# EasyEDA Pro project 平衡车主板.eprj, board PCB1
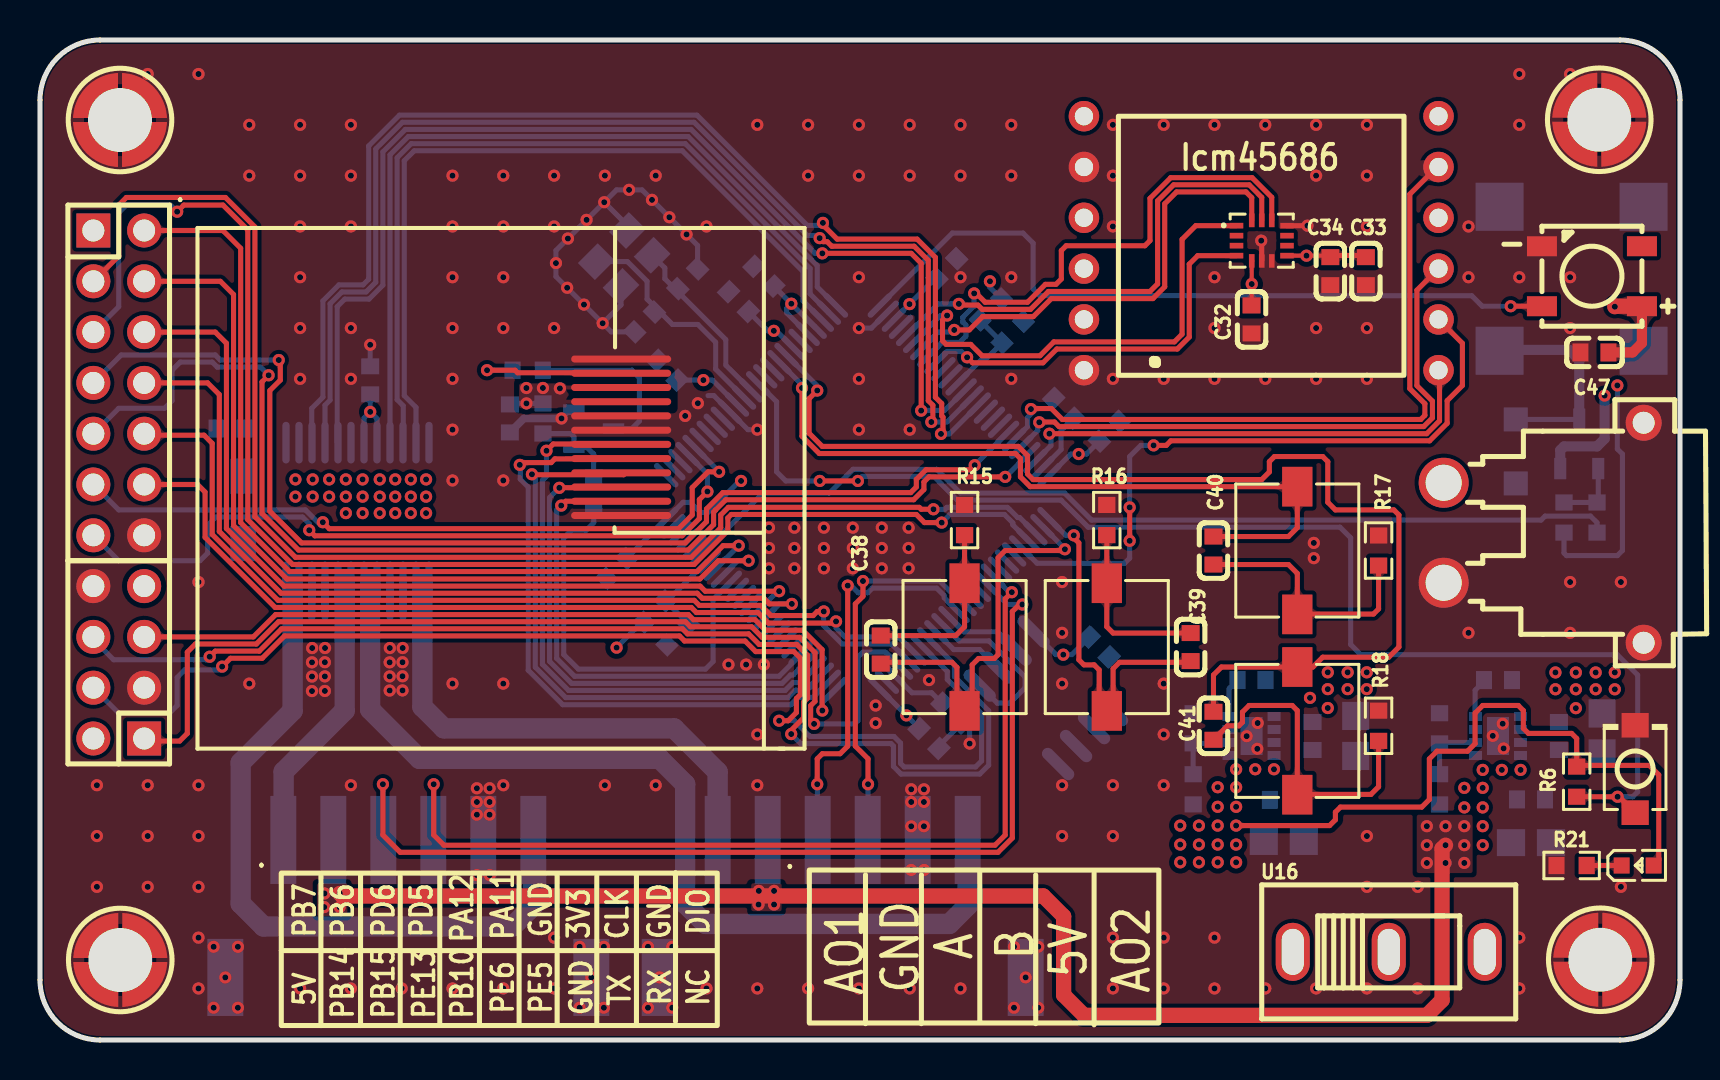
[diagram p1: board, top side]
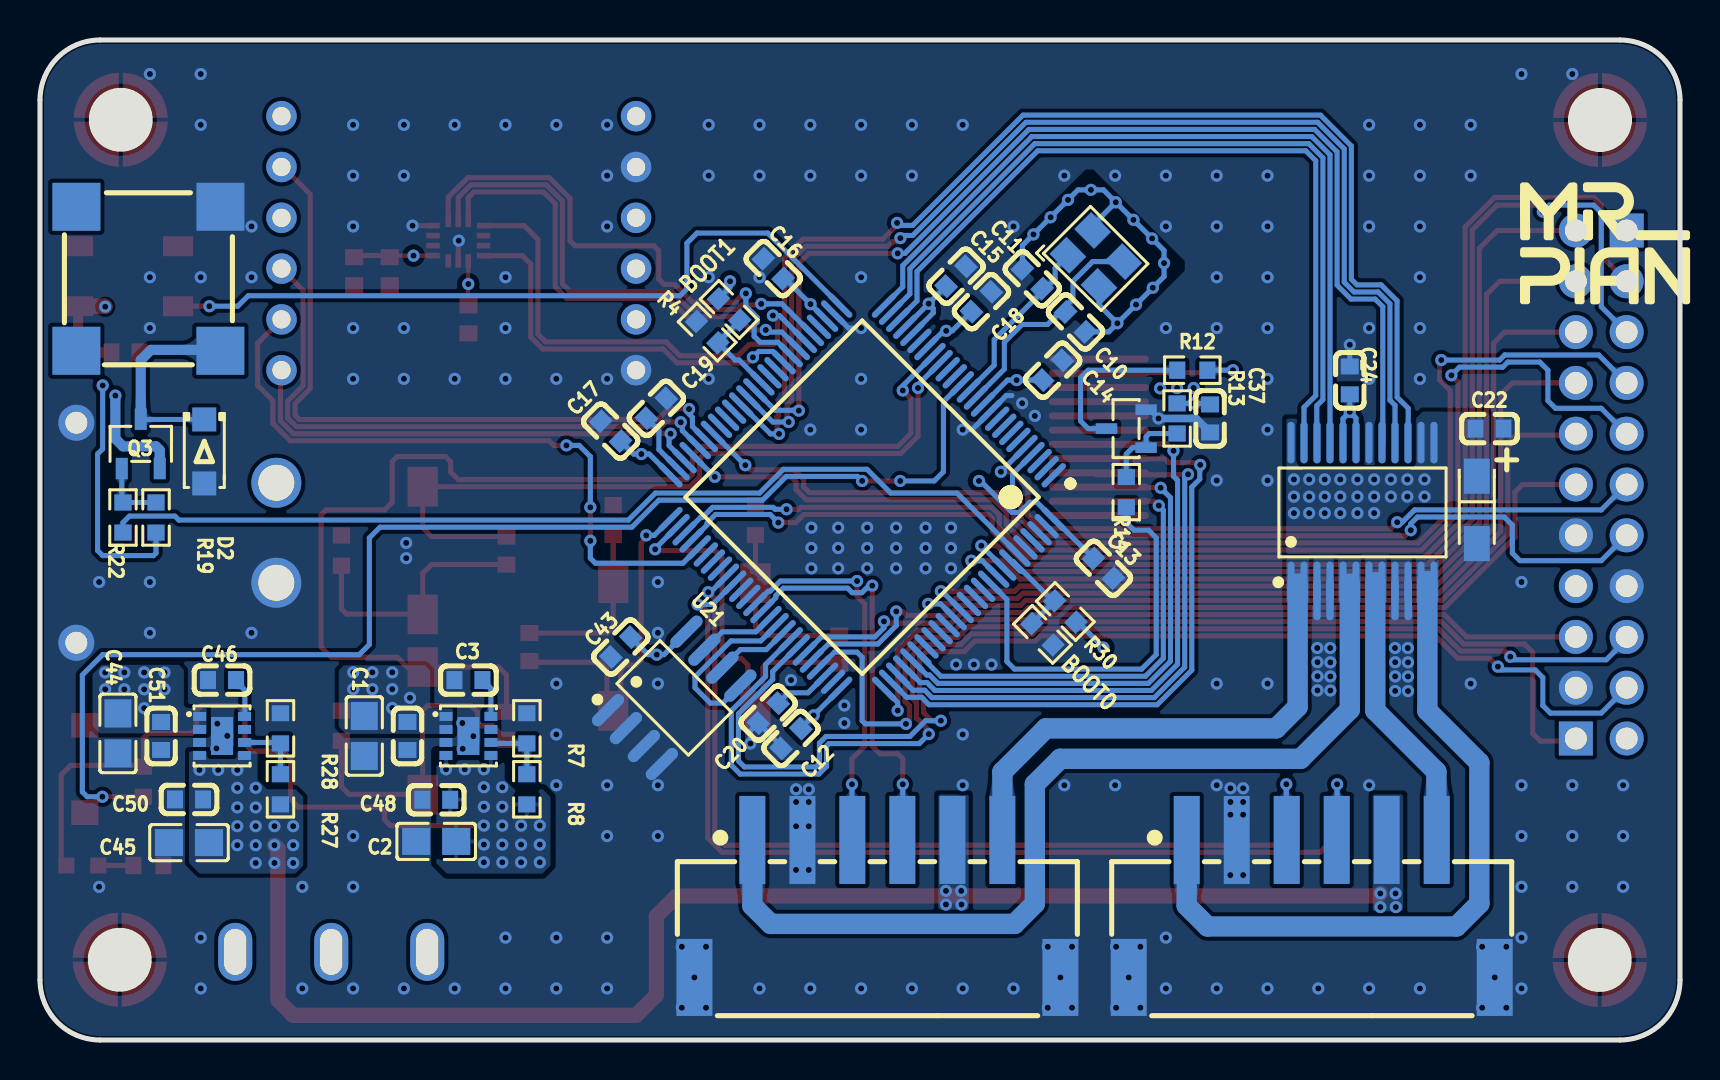
[diagram p2: board, bottom side, seen from below]

Outline 82 x 50 mm; copper layers: Top Layer, PWR, GND, Bottom Layer. Coordinates in mm from the lower left corner of the outline.
Outline path: 0,47 0,3 arc(0.88,0.88) 3,0 79,0 arc(81.12,0.88) 82,3 82,47 arc(81.12,49.12) 79,50 3,50 arc(0.88,49.12) 0,47
Stack: Top Layer 0.035mm 外层铜厚1oz / Dielectric1 0.2104mm 7628 RC49% 8.6mil / PWR 0.035mm / Dielectric2 1.065mm 1.1mm H/HOZ Copper / GND 0.035mm / Dielectric3 0.2104mm 7628 RC49% 8.6mil / Bottom Layer 0.035mm 外层铜厚1oz

## Design rules (mm)
template: 自定义配置
spacing copperThickness1oz (default): track to track 0.102, other pairs 0 to 0.3
spacing copperThickness2oz: track to track 0.203, other pairs 0.152 to 0.3
track width copperThickness1oz (default): min 0.127, default 0.254, max 2.54
track width copperThickness2oz: min 0.203, default 0.254, max 2.54
differential pair differentialPair (default): width min 0.127, default 0.254, max 2.54; gap min 0.152, default 0.152
via viaSize (default): diameter min 0.5, default 0.61, max 10; hole min 0.3, default 0.305, max 6.3
net GND uses innerPlane
net VDD uses copperRegion

## Placement (name value [footprint] x y rotation side)
C1  10uF  [C0805]  65.79 15.2 270 bottom
C2  22uF  [C0805]  62.19 9.93 180 bottom
C3  3.3nF  [C0603]  60.58 18 0 bottom
C10  20pF  [C0603]  30.23 35.9 45 bottom
C11  20pF  [C0603]  32.38 38.06 45 bottom
C12  100nF  [C0603]  44.45 15.08 135 bottom
C13  100nF  [C0603]  28.83 23.58 45 bottom
C14  100nF  [C0603]  31.37 33.49 315 bottom
C15  100nF  [C0603]  36.19 38.19 315 bottom
C16  100nF  [C0603]  45.34 38.57 225 bottom
C17  100nF  [C0603]  53.47 30.44 225 bottom
C18  100nF  [C0603]  34.92 36.92 315 bottom
C19  2.2uF  [C0603]  51.18 31.59 315 bottom
C20  2.2uF  [C0603]  45.59 16.35 135 bottom
C22  100nF  [C0603]  9.52 30.57 180 bottom
C24  100nF  [C0603]  16.51 32.98 90 bottom
C32  10nF  [C0603]  60.58 36.03 90 top
C33  2.2uF  [C0603]  66.29 38.44 90 top
C34  100nF  [C0603]  64.52 38.44 90 top
C35  10uF  [CAP-SMD_L3.2-W1.6-RD-C7171]  10.16 26.51 270 bottom
C37  100nF  [C0603]  23.5 31.08 270 bottom
C38  100nF  [C0603]  42.04 19.52 270 top
C39  100nF  [C0603]  57.53 19.65 270 top
C40  100nF  [C0603]  58.67 24.47 90 top
C41  100nF  [C0603]  58.67 15.71 90 top
C43  100nF  [C0603]  52.96 19.65 315 bottom
C44  10uF  [C0805]  78.1 15.33 270 bottom
C45  22uF  [C0805]  74.55 9.87 180 bottom
C46  3.3nF  [C0603]  72.9 18 0 bottom
C47  100nF  [C0603]  77.72 34.38 0 top
C48  100nF  [C0603]  62.19 12.01 0 bottom
C49  100nF  [C0603]  63.63 15.2 270 bottom
C50  100nF  [C0603]  74.55 12.03 0 bottom
C51  100nF  [C0603]  75.95 15.2 270 bottom
CN1  XT30PW-M30.G.Y  [CONN-TH_XT30PW-M]  75.18 25.36 90 top
CN2  HCZZ0021-6  [CONN-SMD_HCZZ0021-6]  18.41 6.57 180 bottom
CN3  HCZZ0021-6  [CONN-SMD_HCZZ0021-6]  40.13 6.57 180 bottom
D2  1N4007 A7  [SOD-123FL_L2.8-W1.8-LS3.7-RD]  73.79 29.43 270 bottom
H1  PZ254V-12-8P  [HDR-TH_8P-P2.54-V-M-R2-C4-S2.54]  3.94 18.89 90 top
H3  PZ254V-12-14P  [HDR-TH_14P-P2.54-V-M-R2-C7-S2.54]  3.94 32.86 270 top
LED1  NCD0603R1  [LED0603-RD]  79.88 8.73 0 top
LED2  XL-5050RGBC-WS2812B  [LED-SMD_4P-L5.0-W5.0-BL_XL-5050RGBC]  77.6 38.19 90 top
Q3  S8550  [SOT-23-3_L2.9-W1.6-P1.90-LS2.8-BR]  76.96 29.81 270 bottom
Q4  S8050  [SOT-23-3_L2.9-W1.3-P1.90-LS2.3-BR]  27.69 30.57 180 bottom
R4  10kΩ  [R0603]  48.64 35.4 45 bottom
R5  10kΩ  [R0603]  31.88 20.28 225 bottom
R6  10kΩ  [R0603]  76.84 12.92 90 top
R7  24kΩ  [R0603]  57.66 15.58 90 bottom
R8  75kΩ  [R0603]  57.66 12.54 90 bottom
R12  10Ω  [R0603]  24.38 33.49 180 bottom
R13  10kΩ  [R0603]  25.15 31.08 270 bottom
R14  1kΩ  [R0603]  27.69 27.39 90 bottom
R15  10kΩ  [R0603]  46.23 26 270 top
R16  10kΩ  [R0603]  53.34 26 270 top
R17  10kΩ  [R0603]  66.93 24.47 270 top
R18  10kΩ  [R0603]  66.93 15.71 270 top
R19  10kΩ  [R0603]  76.2 26.12 90 bottom
R21  1kΩ  [R0603]  76.58 8.73 0 top
R22  1kΩ  [R0603]  77.85 26.12 90 bottom
R27  52.3kΩ  [R0603]  69.98 12.54 90 bottom
R28  10kΩ  [R0603]  69.98 15.58 90 bottom
R29  0Ω  [R0603]  47.54 36.53 45 bottom
R30  0Ω  [R0603]  30.73 21.43 225 bottom
SW3  TS-1088-AR02016  [SW-SMD_L3.9-W3.0-P4.45]  79.76 13.55 90 top
U1  STM32F407VET6  [LQFP-100_L14.0-W14.0-P0.50-LS16.0-BL]  40.89 27.14 45 bottom
U2  TPS82130SILR  [USIP-8_L3.0-W2.8-P0.65-TL-EP]  60.58 15.2 180 bottom
U3  TB6612FNG(O,C,8,EL  [SSOP-24_L8.4-W5.8-P0.65-LS7.8-BL]  15.88 26.38 180 bottom
U4  ICM-42688-P  [LGA-14_L3.0-W2.5-P0.50-TL]  61.09 39.97 0 top
U6  铜柱M3*5+6  [SMD_BD4.2-L4.7-W4.7-D3.0]  4 46 0 top
U7  铜柱M3*5+6  [SMD_BD4.2-L4.7-W4.7-D3.0]  4.01 4 0 top
U8  铜柱M3*5+6  [SMD_BD4.2-L4.7-W4.7-D3.0]  78.01 4.01 0 top
U9  铜柱M3*5+6  [SMD_BD4.2-L4.7-W4.7-D3.0]  77.96 46.01 0 top
U11  ST7789V-12PIN 1.3寸LCD  [ST7789V-12PIN]  38.23 14.57 90 top
U12  TS-1199A26050  [SW-SMD_L6.0-W6.0-LS6.6]  46.23 19.65 90 top
U13  TS-1199A26050  [SW-SMD_L6.0-W6.0-LS6.6]  53.34 19.65 90 top
U14  TS-1199A26050  [SW-SMD_L6.0-W6.0-LS6.6]  62.87 24.47 270 top
U15  TS-1199A26050  [SW-SMD_L6.0-W6.0-LS6.6]  62.87 15.46 270 top
U16  SS12D10G5  [SW-TH_SHOU-HAN_SS12D10G4]  67.44 4.41 0 top
U18  TPS82130SILR  [USIP-8_L3.0-W2.8-P0.65-TL-EP]  72.9 15.2 180 bottom
U19  2.731kHz  [BUZ-SMD_4P-L8.5-W8.5-P8.50-TL-A]  76.58 38.06 0 bottom
U20  -  [15轴imu]  60.96 40.22 0 top
U21  CAT24C256WI-GT3  [SOIC-8_L4.9-W3.9-P1.27-LS6.0-BL]  50.29 17.11 225 bottom
X1  8MHz  [OSC-SMD_4P-L3.2-W2.5-BL]  29.21 39.08 225 bottom

## Footprints (pads in the part's own frame, mm; a bottom-side part is the same pattern mirrored in y, then rotated)
15轴imu
  round 1.524 hole 0.914: 1(-8.763,-6.731) 2(-8.763,-4.191) 3(-8.763,-1.651) 4(-8.763,0.889) 5(-8.763,3.429) 6(-8.763,5.969) 7(8.966,5.969) 8(8.966,3.429) 9(8.966,0.889) 10(8.966,-1.651) 11(8.966,-4.191) 12(8.966,-6.731)
BUZ-SMD_4P-L8.5-W8.5-P8.50-TL-A
  rect 2.4x2.4 smd: 1(-3.6,3.6) 2(-3.6,-3.6) 3(3.599,-3.599) 4(3.6,3.6)
C0603
  rect 0.8x0.9 smd: 1(-0.7,0) 2(0.7,0)
C0805
  rect 1.41x1.35 smd: 1(-1,0) 2(1,0)
CAP-SMD_L3.2-W1.6-RD-C7171
  rect 1.758x1.296 smd: 1(-1.687,0) 2(1.687,0)
CONN-SMD_HCZZ0021-6
  rect 1.3x4.4 smd: 1(-6.25,3.438) 2(-3.75,3.438) 3(-1.25,3.438) 4(1.25,3.438) 5(3.75,3.438) 6(6.25,3.438)
  rect 1.8x3.85 smd: 7(-9.15,-3.438) 8(9.15,-3.438)
CONN-TH_XT30PW-M
  round 2.5 hole 1.8: 1(-2.5,5) 2(2.5,5)
  round 1.8 hole 1.1: 3(5.5,-5) 4(-5.5,-5)
HDR-TH_8P-P2.54-V-M-R2-C4-S2.54
  rect 1.7x1.7 hole 1.1: 1(-3.81,-1.27)
  round 1.7 hole 1.1: 2(-3.81,1.27) 3(-1.27,-1.27) 4(-1.27,1.27) 5(1.27,-1.27) 6(1.27,1.27) 7(3.81,-1.27) 8(3.81,1.27)
HDR-TH_14P-P2.54-V-M-R2-C7-S2.54
  rect 1.7x1.7 hole 1.1: 1(-7.62,-1.27)
  round 1.7 hole 1.1: 2(-7.62,1.27) 3(-5.08,-1.27) 4(-5.08,1.27) 5(-2.54,-1.27) 6(-2.54,1.27) 7(0,-1.27) 8(0,1.27) 9(2.54,-1.27) 10(2.54,1.27) 11(5.08,-1.27) 12(5.08,1.27) 13(7.62,-1.27) 14(7.62,1.27)
LED0603-RD
  rect 0.8x0.8 smd: 1(-0.799,0) 2(0.799,0)
LED-SMD_4P-L5.0-W5.0-BL_XL-5050RGBC
  rect 1x1.5 smd: 1(-1.5,-2.5) 2(1.5,-2.5) 3(1.5,2.5) 4(-1.5,2.5)
LGA-14_L3.0-W2.5-P0.50-TL
  rect 0.675x0.28 smd: 1(-1.262,0.75) 2(-1.262,0.25) 3(-1.262,-0.25) 4(-1.262,-0.75) 8(1.262,-0.75) 9(1.262,-0.25) 10(1.262,0.25) 11(1.262,0.75)
  rect 0.28x0.675 smd: 5(-0.5,-1.012) 6(0,-1.012) 7(0.5,-1.012) 12(0.5,1.012) 13(0,1.012) 14(-0.5,1.012)
LQFP-100_L14.0-W14.0-P0.50-LS16.0-BL
  oval 0.3x1.6 smd: 1(-6,-7.55) 2(-5.5,-7.55) 3(-5,-7.55) 4(-4.5,-7.55) 5(-4,-7.55) 6(-3.5,-7.55) 7(-3,-7.55) 8(-2.5,-7.55) 9(-2,-7.55) 10(-1.5,-7.55) 11(-1,-7.55) 12(-0.5,-7.55) 13(0,-7.55) 14(0.5,-7.55) 15(1,-7.55) 16(1.5,-7.55) 17(2,-7.55) 18(2.5,-7.55) 19(3,-7.55) 20(3.5,-7.55) 21(4,-7.55) 22(4.5,-7.55) 23(5,-7.55) 24(5.5,-7.55) 25(6,-7.55) 51(6,7.55) 52(5.5,7.55) 53(5,7.55) 54(4.5,7.55) 55(4,7.55) 56(3.5,7.55) 57(3,7.55) 58(2.5,7.55) 59(2,7.55) 60(1.5,7.55) 61(1,7.55) 62(0.5,7.55) 63(0,7.55) 64(-0.5,7.55) 65(-1,7.55) 66(-1.5,7.55) 67(-2,7.55) 68(-2.5,7.55) 69(-3,7.55) 70(-3.5,7.55) 71(-4,7.55) 72(-4.5,7.55) 73(-5,7.55) 74(-5.5,7.55) 75(-6,7.55)
  oval 1.6x0.3 smd: 26(7.55,-6) 27(7.55,-5.5) 28(7.55,-5) 29(7.55,-4.5) 30(7.55,-4) 31(7.55,-3.5) 32(7.55,-3) 33(7.55,-2.5) 34(7.55,-2) 35(7.55,-1.5) 36(7.55,-1) 37(7.55,-0.5) 38(7.55,0) 39(7.55,0.5) 40(7.55,1) 41(7.55,1.5) 42(7.55,2) 43(7.55,2.5) 44(7.55,3) 45(7.55,3.5) 46(7.55,4) 47(7.55,4.5) 48(7.55,5) 49(7.55,5.5) 50(7.55,6) 76(-7.55,6) 77(-7.55,5.5) 78(-7.55,5) 79(-7.55,4.5) 80(-7.55,4) 81(-7.55,3.5) 82(-7.55,3) 83(-7.55,2.5) 84(-7.55,2) 85(-7.55,1.5) 86(-7.55,1) 87(-7.55,0.5) 88(-7.55,0) 89(-7.55,-0.5) 90(-7.55,-1) 91(-7.55,-1.5) 92(-7.55,-2) 93(-7.55,-2.5) 94(-7.55,-3) 95(-7.55,-3.5) 96(-7.55,-4) 97(-7.55,-4.5) 98(-7.55,-5) 99(-7.55,-5.5) 100(-7.55,-6)
OSC-SMD_4P-L3.2-W2.5-BL
  rect 1.4x1.2 smd: 1(-1.1,-0.875) 2(1.1,-0.875) 3(1.1,0.875) 4(-1.1,0.875)
R0603
  rect 0.806x0.864 smd: 1(-0.753,0) 2(0.753,0)
SMD_BD4.2-L4.7-W4.7-D3.0
  custom 2.25x2.25 smd: 1(-1.225,1.443) 1(-1.225,-1.442) 1(1.225,1.443) 1(1.225,-1.443)
SOD-123FL_L2.8-W1.8-LS3.7-RD
  rect 1.2x1.2 smd: 1(-1.6,0) 2(1.6,0)
SOIC-8_L4.9-W3.9-P1.27-LS6.0-BL
  oval 0.588x2.045 smd: 1(-1.905,-2.772) 2(-0.635,-2.772) 3(0.635,-2.772) 4(1.905,-2.772) 5(1.905,2.772) 6(0.635,2.772) 7(-0.635,2.772) 8(-1.905,2.772)
SOT-23-3_L2.9-W1.3-P1.90-LS2.3-BR
  rect 1.07x0.532 smd: 1(0.99,-0.95) 2(0.99,0.95) 3(-0.99,0)
SOT-23-3_L2.9-W1.6-P1.90-LS2.8-BR
  rect 1.07x0.6 smd: 1(1.235,-0.95) 2(1.235,0.95) 3(-1.235,0)
SSOP-24_L8.4-W5.8-P0.65-LS7.8-BL
  oval 0.364x2.082 smd: 1(-3.575,-3.491) 2(-2.925,-3.491) 3(-2.275,-3.491) 4(-1.625,-3.491) 5(-0.975,-3.491) 6(-0.325,-3.491) 7(0.325,-3.491) 8(0.975,-3.491) 9(1.625,-3.491) 10(2.275,-3.491) 11(2.925,-3.491) 12(3.575,-3.491) 13(3.575,3.491) 14(2.925,3.491) 15(2.275,3.491) 16(1.625,3.491) 17(0.975,3.491) 18(0.325,3.491) 19(-0.325,3.491) 20(-0.975,3.491) 21(-1.625,3.491) 22(-2.275,3.491) 23(-2.925,3.491) 24(-3.575,3.491)
ST7789V-12PIN
  custom 0.35x4.999 smd: 1(19.482,9.169) 2(18.77,9.169) 3(18.059,9.169) 4(17.348,9.169) 5(16.637,9.169) 6(15.926,9.169) 7(15.214,9.169) 8(14.504,9.169) 9(13.792,9.169) 10(13.081,9.169) 11(12.37,9.169) 12(11.659,9.169)
SW-SMD_L3.9-W3.0-P4.45
  rect 1.23x1.36 smd: 1(-2.185,0) 2(2.185,0)
SW-SMD_L6.0-W6.0-LS6.6
  rect 1.985x1.512 smd: 1(-3.192,0) 2(3.192,0)
SW-TH_SHOU-HAN_SS12D10G4
  oval 1.7x2.9 hole 1.1x2.3: 1(-4.8,0) 2(0,0) 3(4.8,0)
USIP-8_L3.0-W2.8-P0.65-TL-EP
  rect 0.65x0.45 smd: 1(-1.125,0.975) 2(-1.125,0.325) 3(-1.125,-0.325) 4(-1.125,-0.975) 5(1.125,-0.975) 6(1.125,-0.325) 7(1.125,0.325) 8(1.125,0.975)
  rect 1.1x1.9 smd: 9(0,0)

## Nets
As in the schematic.

Pads without a net: H1 2; LED2 2; U1 1 2 3 6 7 8 9 15 16 29 35 36 41 42 43 56 57 58 61 62 82 83 84 85 88 89 90 96 97 98; U2 7; U4 2 3 9 10; U16 1; U18 7; U19 3 4; U20 2 3 4 7 9

## Via types
v1: diameter 0.61, hole 0.305, Top Layer to Bottom Layer, 416 vias

## Routing (per net, layer and track width the routed paths; a pad name or vN(x,y) marks a point on that pad's centre or on a via; arc(x,y) is an arc through that point)
5V: length 223.5
  Top Layer w0.508: C47.2 79.63,34.38 80.1,34.85 LED2.1
  Top Layer w0.762: v1(14.99,7.33) 15.11,7.2 50.16,7.2 51.18,6.19 51.18,2.25 52.2,1.23 69.34,1.23 70.1,1.99 70.1,9.57 v1(70.28,9.74) ; v1(78.74,36.67) 78.76,36.69 LED2.1
  PWR w0.762: 52.2,48.35 52.2,48.34 U20.6
  PWR w1.778: v1(71.21,12.61) 69.72,14.1 69.72,18.5 68.33,19.9 66.04,19.9 65.04,20.9 65.04,29.19 66.67,30.82 76.58,30.82 78.74,32.98 v1(78.74,36.67) 78.74,40.22 76.71,42.25 73.03,42.25 71.77,43.51 71.77,47.07 70.48,48.35 9.88,48.35 8.64,47.1 8.64,43.78 7.62,42.76 4.17,42.76 2.67,41.26 H3.1
  Bottom Layer w0.254: R19.1 76.2,24.35 76.33,24.22 78.87,24.22 79.12,24.47 79.12,29.3 78.87,29.55 v1(78.87,32.73)
  Bottom Layer w0.508: Q3.2 76.01,29.49 76.2,29.68 77.85,29.68 78.23,30.06 v1(78.23,32.22)
  vias: v1(14.21,6.65) v1(14.22,7.33) v1(14.98,6.65) v1(35.94,7.46) v1(35.93,6.77) v1(36.7,7.46) v1(36.7,6.77) v1(69.34,10.69) v1(69.34,9.74) v1(69.34,8.85) v1(70.28,10.69) v1(70.28,8.85) v1(71.21,11.63) v1(71.21,10.69) v1(71.21,9.74) v1(71.21,8.85) v1(72.14,13.51) v1(72.14,12.61) v1(72.14,11.63) v1(72.14,10.69) v1(72.14,9.74) v1(73.09,13.51) v1(74.03,13.51)
12.6V: length 67.2
  PWR w1.778: 15.75,26.76 15.75,15.46 16.89,14.31 24.26,14.31 25.51,13.06 25.51,8.36 27.05,6.82 32.26,6.82 34.54,4.53 45.09,4.53 47.24,6.69 60.96,6.69 62.74,8.47
  vias: v1(12.77,28.03) v1(12.77,27.17) v1(13.63,28.03) v1(13.63,27.17) v1(14.46,28.03) v1(14.46,27.17) v1(15.29,28.03) v1(15.29,27.17) v1(15.29,26.34) v1(16.13,28.03) v1(16.13,27.17) v1(16.13,26.34) v1(16.99,28.03) v1(16.99,27.17) v1(16.99,26.34) v1(17.76,28.03) v1(17.76,27.17) v1(17.76,26.34) v1(18.54,28.03) v1(18.54,27.17) v1(18.54,26.34) v1(19.3,28.03) v1(19.3,27.17) v1(19.3,26.34) v1(63.5,17.11) v1(64.39,18.38) v1(64.39,17.54) v1(64.39,16.6) v1(65.38,18.38) v1(65.38,17.54) v1(66.34,18.38) v1(66.34,17.54) v1(75.77,18.38) v1(75.77,17.54) v1(76.79,18.38) v1(76.79,17.54) v1(76.79,16.59) v1(77.78,18.38) v1(77.78,17.54) v1(78.74,18.38) v1(78.74,17.54)
12.6V_IN: length 31.1
  PWR w2.159: U16.3 72.24,6.74 73.71,8.22 75.91,8.22 77.34,9.65 77.34,13.68 77.16,13.86 77.16,13.96 74.04,17.08 74.04,26.25 72.43,27.86 CN1.2
GND: length 42.6
  Top Layer w0.254: U4.11 v1(63.37,40.72) ; v1(61.06,39.97) 61.09,39.94 U4.6
  Bottom Layer w0.254: C12.1 44.94,14.71 46.09,15.85 46.48,15.46 v1(46.48,14.82) ; v1(26.08,31.08) 26.52,31.52 Q4.2 ; v1(28.21,41.89) 29.37,40.73 X1.4 ; v1(28.21,41.89) 28.83,42.51 v1(29.45,42.51) 30.1,42.51 v1(30.6,42.01) v1(31.47,41.14) v1(32.33,40.28) 32.88,39.73 C11.2 ; v1(28.21,41.89) v1(27.33,41.01) v1(26.4,40.07) 25.8,39.48 v1(25.8,38.84) 25.8,38.17 v1(26.36,37.61) v1(27.2,36.77) v1(28.13,35.84) ; v1(28.13,35.84) 28.56,35.41 C10.1 ; v1(28.13,35.84) 29.05,36.76 X1.2 ; v1(35.87,30.52) 35.39,30.52 U1.10 33.69,32.22 33.4,32.22 ; 42.34,36.37 41.57,35.6 v1(40.94,35.6) ; C24.2 v1(16.51,34.76)
  Bottom Layer w0.381: C37.2 24.19,31.08 v1(26.08,31.08) ; U3.10 13.59,22.88 13.59,21.17 ; U3.9 14.25,21.17 ; U3.3 18.15,21.17 ; U3.4 17.5,21.17
  vias: v1(2.84,12.74) v1(2.84,10.2) v1(2.84,7.66) v1(5.38,48.3) v1(5.38,12.74) v1(5.38,10.2) v1(5.38,7.66) v1(7.92,48.3) v1(7.92,22.9) v1(7.92,12.74) v1(7.92,10.2) v1(7.92,7.66) v1(7.92,5.12) v1(7.92,2.58) v1(8.68,4.66) v1(8.68,1.61) v1(9.27,3.13) v1(9.89,4.66) v1(9.89,1.61) v1(10.46,45.76) v1(10.46,43.22) v1(10.46,17.82) v1(13,45.76) v1(13,43.22) v1(13,40.68) v1(13,38.14) v1(13,35.6) v1(13,33.06) v1(13,2.58) v1(13.61,19.6) v1(13.6,18.88) v1(13.6,18.17) v1(13.6,17.45) v1(14.25,19.6) v1(14.24,18.89) v1(14.24,18.18) v1(14.24,17.45) v1(15.55,45.76) v1(15.55,43.22) v1(15.55,40.68) v1(15.55,35.6) v1(15.55,33.06) v1(15.55,12.74) v1(15.55,2.58) v1(17.49,19.6) v1(17.48,18.88) v1(17.48,18.18) v1(17.48,17.47) v1(18.08,2.58) v1(18.13,19.6) v1(18.13,18.89) v1(18.13,18.19) v1(18.13,17.48) v1(20.62,43.22) v1(20.62,40.68) v1(20.62,38.14) v1(20.62,35.6) v1(20.62,33.06) v1(20.62,30.52) v1(20.62,27.98) v1(20.62,17.82) v1(20.62,2.58) v1(21.84,12.59) v1(21.84,11.9) v1(21.84,11.27) v1(21.84,8.25) v1(22.48,12.59) v1(22.48,11.9) v1(22.48,11.27) v1(22.48,8.25) v1(23.16,43.22) v1(23.16,40.68) v1(23.16,38.14) v1(23.16,35.6) v1(23.16,27.98) v1(23.16,17.82) v1(23.16,12.74) v1(23.16,2.58) v1(25.7,43.22) v1(25.7,40.68) v1(25.7,35.6) v1(25.7,5.12) v1(25.7,2.58) v1(26.98,4.66) v1(26.98,1.61) v1(27.56,3.13) v1(28.19,4.66) v1(28.19,1.61) v1(28.25,43.22) v1(28.25,12.74) v1(30.4,4.66) v1(30.4,1.61) v1(30.78,43.22) v1(30.78,12.74) v1(30.98,3.13) v1(31.61,4.66) v1(31.61,1.61) v1(32.26,31.2) v1(32.89,31.84) v1(33.32,40.68) v1(33.32,2.58) v1(34.42,18.77) v1(35.31,18.77) v1(35.87,45.76) v1(35.87,15.28) v1(35.87,12.74) v1(35.87,2.58) v1(36.19,18.77) v1(36.45,25.62) v1(36.45,24.6) v1(36.45,23.58) v1(37.72,25.62) v1(37.72,24.6) v1(37.72,23.58) v1(38.41,45.76) v1(38.41,43.22) v1(38.41,2.58) v1(39.2,25.62) v1(39.2,24.6) v1(39.2,23.58) v1(40.64,25.62) v1(40.64,24.6) v1(40.64,23.58) v1(40.94,45.76) v1(40.94,43.22) v1(40.94,38.14) v1(40.94,33.06) v1(40.94,30.52) v1(40.94,2.58) v1(41.78,16.73) v1(41.78,15.85) v1(42.09,25.62) v1(42.09,24.6) v1(42.09,23.58) v1(43.48,45.76) v1(43.48,43.22) v1(43.48,30.52) v1(43.43,25.62) v1(43.43,24.6) v1(43.43,23.58) v1(43.48,2.58) v1(43.56,12.54) v1(43.56,11.9) v1(43.56,10.69) v1(43.56,8.5) v1(44.2,12.54) v1(44.2,11.9) v1(44.2,10.69) v1(44.2,8.5) v1(44.45,18) v1(46.03,45.76) v1(46.03,43.22) v1(46.03,38.14) v1(46.03,2.58) v1(48.56,45.76) v1(48.56,43.22) v1(48.56,38.14) v1(48.56,33.06) v1(48.7,4.66) v1(48.7,1.61) v1(49.28,3.13) v1(49.91,4.66) v1(49.91,1.61) v1(51.1,22.9) v1(51.1,20.36) v1(51.1,17.82) v1(51.1,12.74) v1(51.1,10.2) v1(53.64,45.76) v1(53.64,43.22) v1(53.64,40.68) v1(53.64,33.06) v1(53.64,12.74) v1(53.64,10.2) v1(53.64,5.12) v1(53.64,2.58) v1(56.19,45.76) v1(56.19,33.06) v1(56.19,17.82) v1(56.19,15.28) v1(56.19,12.74) v1(56.19,5.12) v1(56.19,2.58) v1(58.72,45.76) v1(58.72,38.14) v1(58.72,35.6) v1(58.72,33.06) v1(58.72,5.12) v1(58.72,2.58) v1(60.33,15.19) v1(60.88,15.85) v1(60.86,14.56) v1(61.26,45.76) v1(61.26,33.06) v1(61.26,2.58) v1(63.69,24.85) v1(63.69,24.09) v1(63.81,45.76) v1(63.81,43.22) v1(63.81,35.6) v1(63.81,33.06) v1(63.81,2.58) v1(66.34,45.76) v1(66.34,43.22) v1(66.34,40.68) v1(66.34,35.6) v1(66.34,33.06) v1(66.34,10.2) v1(66.34,7.66) v1(66.34,2.58) v1(68.88,7.66) v1(68.88,2.58) v1(71.42,40.68) v1(71.42,38.14) v1(71.42,20.36) v1(72.64,15.21) v1(73.13,15.81) v1(73.18,14.58) v1(73.97,48.3) v1(73.97,45.76) v1(73.97,38.14) v1(73.97,5.12) v1(73.97,2.58) v1(76.5,48.3) v1(76.5,38.14) v1(76.5,35.6) v1(76.5,22.9) v1(76.5,20.36) v1(79.04,22.9) v1(79.04,7.66)
VDD: length 80.4
  Top Layer w0.203: C32.2 60.59,36.74 v1(60.59,37.8) U4.5 ; C34.2 64.44,39.22 v1(63.32,39.22) U4.8
  Top Layer w0.254: 60.58,38.95 U4.5 ; v1(59.81,10.72) 64.48,10.72 64.77,11.01 64.77,11.39 65.02,11.65 69.09,11.65 69.47,12.03 69.47,14.06 69.85,14.44 71.37,14.44 71.75,14.82 71.75,16.35 72.14,16.73 73.91,16.73 74.17,16.47 74.17,15.58 74.42,15.33 76.58,15.33 76.84,15.08 R6.2 76.9,13.73 80.47,13.73 80.94,13.26 80.94,8.98 LED1.2 ; C34.2 64.6,39.23 66.21,39.23 C33.2
  Bottom Layer w0.254: U1.75 v1(43.32,16.23) 43.83,15.72 43.83,15.57 ; v1(35.05,27.95) 34.98,27.95 33.4,26.38 33.02,26.38 32.51,26.89 32.15,26.89 31.31,26.04 31.29,26.04 C13.2 ; C37.1 23.55,31.83 v1(24.32,31.83) R13.1 ; v1(16.51,31.41) 16.85,31.07 U3.20 ; v1(16.51,31.41) 16.2,31.1 U3.19 ; v1(16.51,31.41) C24.1 ; 52.97,29.95 52.32,29.3 v1(51.93,29.3) 51.54,29.3 U1.50 ; 37.57,36.81 37.34,36.58 37.34,36.35 U1.21 ; 37.57,36.81 38.72,35.66 U1.22 ; 37.57,36.81 v1(37.57,36.82) ; 37.57,36.81 36.69,37.69 ; 42.7,36.01 42.7,36.02 v1(43.47,36.79) 44.75,38.08 44.84,38.08 ; R29.2 47.5,37.64 v1(47.5,37.94) ; C14.2 v1(33.17,33) 33.62,33 U1.11 ; R30.2 30.1,20.89 v1(28.83,19.62) ; 52.46,20.14 51.59,19.27 v1(51.16,19.27) 50.8,19.27 49.68,20.39 U21.8 ; C18.2 36.39,35.46 v1(36.69,35.46) 36.69,35.46 36.82,35.46 37.68,34.6
  vias: v1(24.32,32.6) v1(25.15,32.6) v1(26,32.58) v1(57.01,10.72) v1(57.01,9.77) v1(57.01,8.88) v1(57.95,10.72) v1(57.95,9.77) v1(57.95,8.88) v1(58.88,12.64) v1(58.88,11.66) v1(58.88,10.72) v1(58.88,9.77) v1(58.88,8.88) v1(59.81,13.54) v1(59.81,12.64) v1(59.81,11.66) v1(59.81,9.77) v1(59.81,8.88) v1(60.76,13.54) v1(61.7,13.54)
8M_IN: length 8.8
  Bottom Layer w0.254: U1.13 34.29,33.74 34.29,35.01 31.24,38.06 31.24,38.6 X1.1
8M_OUT: length 11.5
  Bottom Layer w0.254: X1.3 29.37,38.92 30.35,37.94 30.35,37.05 31.62,35.78 32.89,35.78 33.78,34.89 33.78,33.55 35.2,32.13
AIN1: length 41.2
  Bottom Layer w0.254: U3.21 17.5,44.26 18.41,45.17 32.41,45.17 38.86,38.72 38.86,37.66 39.8,36.72
AIN2: length 40.5
  Bottom Layer w0.254: U3.22 18.16,29.88 18.16,31.71 17.86,32.02 17.86,44.11 18.56,44.82 32.26,44.82 38.51,38.57 38.51,37.31 39.44,36.37
AO1: length 25.7
  Bottom Layer w1.016: 19.12,22.82 19.12,16.66 20.19,15.58 31.7,15.58 33.88,13.4 CN3.6
AO2: length 47.8
  Bottom Layer w1.016: 16.51,22.82 16.51,16.52 18.97,14.06 30.99,14.06 32.26,12.79 32.26,6.82 33.27,5.8 45.47,5.8 46.38,6.72 CN3.1
BIN1: length 56.3
  Top Layer w0.254: v1(39.12,39.33) 43.56,39.33 44.06,38.83 v1(44.06,31.47)
  Bottom Layer w0.254: v1(44.06,31.47) 44.31,31.47 44.32,31.48 45.24,31.48 U1.38 ; 14.9,29.87 14.86,29.91 14.86,36.67 15.24,37.05 16.45,37.05 17.14,37.74 17.14,44.41 18.27,45.53 32.56,45.53 38.75,39.33 v1(39.12,39.33)
BIN2: length 58.2
  Top Layer w0.254: v1(38.98,40.09) 39.16,39.92 39.36,39.92 39.59,39.69 43.71,39.69 44.41,38.98 44.41,31.97 44.64,31.74 44.64,30.98 v1(44.57,30.9)
  Bottom Layer w0.254: U1.39 45.36,30.9 v1(44.57,30.9) ; v1(38.98,40.09) 38.85,40.23 38.36,40.23 32.7,45.89 18.12,45.89 16.79,44.55 16.79,37.89 16.3,37.4 15.09,37.4 14.5,36.81 14.5,31.99 14.25,31.74 U3.16
BLK: length 20.6
  Bottom Layer w0.254: R14.1 27.69,25.87 27.31,25.49 26.57,25.49 26.19,25.11 26.19,19.27 26.92,18.54 33.27,18.54 33.66,18.92 33.66,22.02 34.49,22.86
BO1: length 36
  Bottom Layer w1.016: CN2.1 24.66,6.72 23.62,5.68 11.18,5.68 10.03,6.82 10.03,13.87 12.63,16.46 12.63,22.95
BO2: length 14
  Bottom Layer w1.016: 12.11,10.17 12.18,10.24 12.18,13.42 15.23,16.47 15.23,22.89
BOOT0: length 4.6
  Bottom Layer w0.254: U1.94 33.33,23.92 31.37,21.96 R30.1 R5.1
BOOT1: length 4.6
  Bottom Layer w0.254: R4.1 47.24,34 47.04,34 U1.37 ; 48,34.93 48,34.98 46.94,36.04
BUZZ: length 48.3
  Bottom Layer w0.254: R22.1 77.85,25.87 77.53,26.2 75.25,26.2 75.06,26 52.58,26 51.23,27.35 46.02,27.35 44.83,28.54 40.65,28.54 39.46,27.35 36.15,27.35 33.08,24.28 U1.95
CLK: length 24.8
  Top Layer w0.254: U4.13 61.09,42.13 60.46,42.76 56.68,42.76 55.88,41.96 55.88,37.81 55.5,37.43 50.42,37.43 49.52,36.53 47.11,36.53 46.9,36.75 46,36.75 v1(45.94,36.81)
  Bottom Layer w0.254: v1(45.94,36.81) 45.6,36.81 45.6,36.81 45.11,36.81 45.11,36.81 44.9,36.81 43.4,35.31
CS: length 25.9
  Top Layer w0.254: v1(46.71,37.33) 46.81,37.33 47.26,36.89 49.38,36.89 50.27,37.78 50.8,37.78 51.07,38.05 51.07,39.47 51.31,39.71 55.25,39.71 55.5,39.97 55.5,42.08 56.54,43.12 60.6,43.12 61.59,42.13 U4.12
  Bottom Layer w0.254: 44.46,34.24 45.1,34.88 45.99,34.88 46.29,35.19 46.29,35.74 46.14,35.9 46.14,36.13 46.71,36.7 v1(46.71,37.33)
DC: length 29.3
  Top Layer w0.254: 29.1,29.8 25.66,29.8 v1(25.32,29.46)
  Bottom Layer w0.254: v1(25.32,29.46) 25.32,28.19 25.18,28.04 25.12,27.98 25.12,18.79 26.43,17.48 37.25,17.48 37.65,17.87 37.99,17.87 U1.79
E1A: length 20.1
  Top Layer w0.254: v1(38.86,12.79) 38.86,14.06 39.12,14.31 40,14.31 40.39,14.69 v1(40.39,22.72)
  Bottom Layer w0.254: CN3.4 38.86,10.02 v1(38.86,12.79) ; v1(40.39,22.72) 40.55,22.72 40.91,22.37 41.39,22.37 41.62,22.59 44.83,22.59 45.21,22.22 45.21,22.12 45.88,21.45
E1B: length 18.9
  Top Layer w0.254: v1(41.15,22.95) 41.15,22.19 40.77,21.81 40.77,14.69 41.4,14.06 v1(41.4,12.79)
  Bottom Layer w0.254: U1.63 45.59,22.44 45.49,22.44 44.98,22.95 v1(41.15,22.95) ; CN3.3 41.4,10.02 v1(41.4,12.79)
E2A: length 51.7
  Top Layer w0.254: v1(17.14,12.79) 17.14,10.25 18.01,9.39 47.9,9.39 48.62,10.1 48.62,21.43 48.97,21.78 v1(49.12,21.78)
  Bottom Layer w0.254: CN2.4 17.14,10.02 v1(17.14,12.79) ; v1(49.12,21.78) 48.38,21.78 47.29,22.86
E2B: length 47.9
  Top Layer w0.254: v1(48.59,22.39) 48.26,22.06 48.26,10.25 47.75,9.74 20.19,9.74 19.69,10.25 v1(19.69,12.79)
  Bottom Layer w0.254: v1(48.59,22.39) 48.47,22.39 U1.59 ; v1(19.69,12.79) 19.69,10.02 CN2.3
IMU_MCU_RX: length 24.1
  Top Layer w0.254: 69.93,33.49 69.98,33.44 69.98,30.96 69.33,30.32 v1(50.47,30.32)
  Bottom Layer w0.254: v1(50.47,30.32) 50.55,30.24 50.55,29.72 49.77,28.94
IMU_MCU_TX: length 33.5
  Top Layer w0.254: U20.11 71.12,34.84 71.12,32.73 70.36,31.97 70.36,30.84 69.48,29.96 56.54,29.96 56.31,29.73 v1(55.68,29.73) ; v1(54.48,24.96) v1(54.48,26.63)
  Bottom Layer w0.254: v1(54.48,26.63) 54.48,29.17 55.04,29.73 v1(55.68,29.73) ; U1.55 49.85,23.84 54.23,23.84 54.48,24.09 v1(54.48,24.96)
INT1: length 19.8
  Top Layer w0.254: U4.4 57.89,39.22 57.46,38.79 57.46,35.15 56.87,34.55 50.84,34.55 50.15,33.86 46.63,33.86 v1(46.35,34.13)
  Bottom Layer w0.254: U1.34 45.35,34.43 46.06,34.43 v1(46.35,34.13)
IO: length 29.8
  Top Layer w0.254: v1(49.96,30.89) 49.98,30.9 50.72,30.9 50.95,30.67 69.19,30.67 69.62,31.11 69.62,31.94 68.85,32.72 68.85,37.49 69.93,38.57
  Bottom Layer w0.254: 49.06,29.65 49.89,30.48 49.89,30.81 v1(49.96,30.89)
KEY1: length 20.2
  Top Layer w0.254: v1(51.24,24.54) 51.18,24.47 48.26,24.47 47.9,24.12 47.9,19.27 47.71,19.08 46.93,19.08 46.61,18.76 46.61,16.84 U12.1 45.85,16.84 45.85,18.63 45.59,18.89 42.1,18.89 C38.2
  Bottom Layer w0.254: 50.12,25.69 51.24,24.57 v1(51.24,24.54)
KEY2: length 17.6
  Top Layer w0.254: v1(51.69,25.24) 51.69,25.11 51.94,24.85 51.94,19.01 52.2,18.76 52.7,18.76 52.96,18.5 52.96,16.84 U13.1 53.66,16.77 53.66,18.57 53.97,18.89 57.47,18.89 C39.2
  Bottom Layer w0.254: 50.47,26.04 51.28,25.24 v1(51.69,25.24)
KEY3: length 36.9
  Top Layer w0.254: v1(38.1,32.6) 38.1,30.19 38.96,29.32 48.77,29.32 49.02,29.07 49.02,28.15 49.51,27.67 U14.1 62.87,25.62 62.42,25.17 C40.2
  Bottom Layer w0.254: U1.17 38.1,32.76 v1(38.1,32.6)
KEY4: length 57.2
  Top Layer w0.254: C41.2 58.67,18.25 59.07,18.65 U15.1 63.64,18.65 64.13,19.14 67.44,19.14 67.94,19.65 67.94,26.25 67.69,26.51 64.77,26.51 64.39,26.89 64.39,28.92 64.13,29.17 61.72,29.17 61.47,28.92 61.47,28.4 61.09,28.02 49.66,28.02 49.38,28.3 49.38,29.22 48.92,29.68 39.11,29.68 38.46,30.34 38.46,32.07 v1(38.86,32.47)
  Bottom Layer w0.254: v1(38.86,32.47) 38.86,32.71 U1.18
LCD_CS: length 32
  Top Layer w0.254: v1(23.99,28.76) 24.1,28.87 25.56,28.87 25.75,29.06 29.17,29.06
  Bottom Layer w0.254: U1.77 38.66,17.13 37.92,17.13 37.55,16.76 26.14,16.76 24.41,18.49 24.41,27.65 24.01,28.04 24.01,28.53 23.99,28.55 v1(23.99,28.76)
LCD_MOSI: length 25.7
  Top Layer w0.254: v1(25.97,27.61) 25.97,27.62 28.99,27.62
  Bottom Layer w0.254: U1.80 37.66,18.25 37.52,18.25 37.1,17.83 26.58,17.83 25.48,18.94 25.48,27.12 v1(25.97,27.61)
LCD_RST: length 23.9
  Top Layer w0.254: v1(26.06,26.72) 26.28,26.94 U11.11
  Bottom Layer w0.254: U1.81 38.03,19.26 36.96,18.19 26.73,18.19 25.83,19.08 25.83,26.49 v1(26.06,26.72)
LCD_SCK: length 29.9
  Top Layer w0.254: 29.25,28.33 29.18,28.26 24.62,28.26 v1(24.6,28.29)
  Bottom Layer w0.254: v1(24.6,28.29) 24.76,28.12 24.76,18.64 26.29,17.12 37.4,17.12 37.77,17.49 38.35,17.49 39.09,18.23 U1.78
MCU_RX: length 61.3
  Top Layer w0.254: v1(9.11,18.67) 9.52,19.09 11.11,19.09 12.23,20.2 31.97,20.2 32.23,19.95 35.26,19.95 35.78,19.42 37.69,19.42 38.02,19.09 38.02,17.28 37.82,17.08 37.82,16.37 37.41,15.96 v1(36.96,15.96)
  Bottom Layer w0.254: v1(36.96,15.96) 37.72,15.96 38.51,15.18 42.7,15.18 43.03,14.85 43.03,13.83 43.2,13.65 46.78,13.65 47.08,13.95 47.08,16.31 45.36,18.03 45.36,18.43 U1.69 ; v1(9.11,18.67) 8.94,18.5 7.24,18.5 6.86,18.12 6.86,16.73 6.48,16.35 3.94,16.35 H1.4
MCU_TX: length 60.7
  Top Layer w0.254: v1(8.48,19.16) 8.76,19.44 10.96,19.44 12.08,20.56 32.12,20.56 32.38,20.31 35.43,20.31 35.96,19.78 37.84,19.78 38.38,19.24 38.38,17.09 38.18,16.89 38.18,16.1 37.56,15.49 v1(37.56,15.3)
  Bottom Layer w0.254: U1.68 45.72,18.78 45.72,18.17 47.43,16.46 47.43,13.74 46.99,13.3 43.05,13.3 42.67,13.68 42.67,14.7 42.55,14.82 38.04,14.82 v1(37.56,15.3) ; v1(8.48,19.16) 8.33,19.01 3.68,19.01 2.67,20.03 H1.6
MISO: length 24
  Top Layer w0.254: U4.1 57.79,40.72 57.1,40.03 57.1,35.29 56.72,34.91 50.69,34.91 50,34.21 47.1,34.21 46.53,34.78 45.31,34.78 45.13,34.96 45.13,36 v1(45.35,36.22)
  Bottom Layer w0.254: v1(45.35,36.22) 45.03,36.22 U1.31
MOSI: length 23.4
  Top Layer w0.254: U4.14 60.59,42.12 60.3,42.41 56.83,42.41 56.24,41.81 56.24,37.66 55.65,37.07 50.57,37.07 49.66,36.17 47.13,36.17 46.46,35.5 v1(45.71,35.5)
  Bottom Layer w0.254: 44.11,34.6 44.91,35.4 45.6,35.4 v1(45.71,35.5)
PA11: length 43.6
  Top Layer w0.254: H3.12 7.87,27.78 8.25,27.4 8.25,25.13 11.76,21.63 32.56,21.63 32.82,21.37 35.9,21.37 36.43,20.84 39.72,20.84 v1(39.8,20.93)
  Bottom Layer w0.254: v1(39.8,20.93) 39.8,20.61 40.25,20.16 42.93,20.16 U1.70
PA12: length 46.1
  Top Layer w0.254: H3.10 5.28,30.24 8.2,30.24 8.61,29.83 8.61,25.28 11.91,21.98 32.71,21.98 32.97,21.73 36.04,21.73 36.55,21.22 38.66,21.22 38.87,21.43 v1(39.19,21.43)
  Bottom Layer w0.254: 43.4,18.97 42.58,19.8 40.11,19.8 39.19,20.72 v1(39.19,21.43)
PB6: length 45.1
  Top Layer w0.254: v1(35.43,23.97) 33.91,23.97 33,23.05 12.35,23.05 9.68,25.72 9.68,37.28 9.02,37.94 H3.4
  Bottom Layer w0.254: U1.92 34.89,23.97 v1(35.43,23.97)
PB7: length 47
  Top Layer w0.254: H3.2 9.14,40.48 10.03,39.59 10.03,25.87 12.48,23.42 32.86,23.42 34.15,24.72 v1(34.94,24.72)
  Bottom Layer w0.254: U1.93 v1(34.94,24.72)
PB10: length 60.1
  Top Layer w0.254: v1(48.26,28.16) 44.45,28.16 44.2,27.9 44.2,27.53 43.68,27.01 34.29,27.01 33.78,26.51 33.78,26.5 33.68,26.4 33.68,25.77 32.41,24.5 12.93,24.5 11.1,26.33 11.1,32.91 v1(11.43,33.24)
  Bottom Layer w0.254: H3.9 3.94,31.59 6.22,31.59 6.6,31.97 6.6,33.49 7.01,33.9 8.61,33.9 8.86,33.64 11.02,33.64 v1(11.43,33.24) ; U1.47 48.27,28.16 v1(48.26,28.16)
PB14: length 68.3
  Top Layer w0.254: H3.3 3.94,39.21 3.94,41.75 4.32,42.13 9.27,42.13 10.74,40.65 10.74,26.17 12.78,24.13 32.56,24.13 34.04,25.61 34.04,26.25 34.42,26.63 43.96,26.63 44.06,26.54 v1(44.67,26.54)
  Bottom Layer w0.254: 49.77,25.34 48.98,26.12 48.88,26.12 48.47,26.54 48.47,26.54 48.37,26.63 45.34,26.63 45.25,26.54 v1(44.67,26.54)
PB15: length 70.7
  Top Layer w0.254: v1(6.86,41.42) 7.19,41.75 9.15,41.75 10.39,40.5 10.39,26.02 12.63,23.78 32.71,23.78 34.39,25.46 34.39,26.1 34.56,26.28 43.81,26.28 44.22,25.87 v1(45.09,25.87)
  Bottom Layer w0.254: v1(45.09,25.87) 45.49,26.28 48.22,26.28 48.64,25.86 48.64,25.76 U1.54 ; H3.5 3.94,36.67 3.94,41.36 4.32,41.75 6.53,41.75 v1(6.86,41.42)
PD5: length 42.6
  Top Layer w0.254: H3.8 8.38,32.86 8.96,32.27 8.96,25.43 12.05,22.34 32.86,22.34 33.11,22.09 36.19,22.09 36.47,21.81 v1(37.59,21.81)
  Bottom Layer w0.254: U1.86 36.97,21.81 v1(37.59,21.81)
PD6: length 44
  Top Layer w0.254: v1(36.96,22.44) 33.26,22.44 33.01,22.7 12.2,22.7 9.32,25.58 9.32,34.84 8.76,35.4 H3.6
  Bottom Layer w0.254: v1(36.96,22.44) 36.9,22.44 35.91,21.45
PE5: length 37.3
  Top Layer w0.254: v1(13.46,25.49) 13.74,25.21 32.11,25.21 32.97,26.07 32.97,27.02 v1(33.37,27.42)
  Bottom Layer w0.254: v1(33.37,27.42) 33.37,28.3 U1.4 ; H3.13 3.94,23.97 8,23.97 8.38,24.35 8.38,25.74 8.79,26.15 13.12,26.15 13.46,25.81 v1(13.46,25.49)
PE6: length 35.9
  Top Layer w0.254: v1(33.96,28.41) 33.4,28.41 32.61,27.62 32.61,26.25 31.92,25.57 14.46,25.57 v1(14.14,25.89)
  Bottom Layer w0.254: 32.73,29.65 33.96,28.42 v1(33.96,28.41) ; H3.11 3.94,26.51 13.27,26.51 13.89,25.89 v1(14.14,25.89)
PE13: length 58.2
  Top Layer w0.254: v1(46.74,28.74) 46.51,28.51 44.3,28.51 43.81,28.03 43.81,27.65 43.54,27.37 34.14,27.37 33.32,26.55 33.32,25.92 32.26,24.85 13.08,24.85 11.49,26.44 11.49,32.47 12.01,32.99 12.01,33.92 v1(11.94,34)
  Bottom Layer w0.254: v1(11.94,34) 9.02,34 8.76,34.25 4.06,34.25 H3.7 ; 48.35,30.36 46.74,28.74
PWMA: length 39.8
  Bottom Layer w0.254: 39.09,36.01 38.15,36.96 38.15,38.43 32.11,44.46 18.71,44.46 18.21,43.96 18.21,32.22 18.8,31.63 18.8,29.87
PWMB: length 60.3
  Top Layer w0.254: v1(39.14,40.86) 39.22,40.78 39.22,40.68 39.86,40.04 43.86,40.04 44.77,39.13 44.77,32.14 45.09,31.82 45.09,31.21 45.15,31.14 45.15,30.41 v1(45.05,30.3)
  Bottom Layer w0.254: v1(39.14,40.86) 39.02,40.73 38.36,40.73 32.85,46.24 17.97,46.24 16.43,44.7 16.43,38.04 16.15,37.76 14.94,37.76 14.15,36.96 14.15,32.14 13.59,31.59 13.59,29.88 U3.15 ; v1(45.05,30.3) 45.47,30.3 U1.40
RST: length 65.6
  Top Layer w0.254: SW3.1 78.96,12.16 v1(78.88,12.16) R6.1 ; v1(40.89,27.95) v1(38.99,27.95)
  Bottom Layer w0.254: v1(38.99,27.95) 37.29,27.95 36.83,28.41 36.83,31.91 U1.14 ; v1(78.88,12.16) 79.64,12.16 79.88,12.41 79.88,18.25 78.87,19.27 66.04,19.27 65.53,19.77 65.53,25.11 65,25.64 52.41,25.64 51.06,26.99 45.87,26.99 44.68,28.18 41.12,28.18 v1(40.89,27.95)
SCL: length 3.8
  Bottom Layer w0.254: U21.6 46.98,19.52 45.69,19.52 U1.67
SDA: length 8.6
  Bottom Layer w0.254: U1.66 45.96,19.95 47.45,19.95 49.25,18.16 49.25,17.61 48.48,16.84 47.86,16.84 U21.5
SWCLK: length 39.5
  Top Layer w0.254: H1.5 10.67,20.16 11.78,21.27 32.42,21.27 32.67,21.02 35.75,21.02 36.28,20.49 38.13,20.49 39.11,19.52 39.11,16.48 v1(39.12,16.47)
  Bottom Layer w0.254: 39.8,17.56 39.12,16.88 v1(39.12,16.47)
SWDIO: length 50.8
  Top Layer w0.254: H1.1 5.33,14.95 6.98,14.95 7.37,15.33 7.37,19.39 7.77,19.8 10.82,19.8 11.93,20.92 32.27,20.92 32.52,20.66 35.58,20.66 36.11,20.13 37.99,20.13 38.75,19.37 38.75,16.93 38.53,16.71 38.53,15.98 v1(38.7,15.81)
  Bottom Layer w0.254: v1(38.7,15.81) 40.74,15.81 40.89,15.96 40.89,19.14 41.15,19.39 42.28,19.39 U1.72
VCAP_1: length 3.1
  Bottom Layer w0.254: 50.12,28.59 51.05,29.52 51.05,30.47 51.68,31.09
VCAP_2: length 3
  Bottom Layer w0.254: 45.1,16.84 44.58,17.36 43.6,17.36 U1.73
WAKE_UP: length 35.2
  Top Layer w0.254: U20.8 69.85,43.65 68.49,42.29 68.49,32.57 69.24,31.82 69.24,31.23 69.04,31.03 51.12,31.03 50.57,31.57 49.65,31.57
  Bottom Layer w0.254: U1.45 49.38,30.67 49.38,31.13 49.55,31.3 v1(49.55,31.55)
WC#: length 3.9
  Bottom Layer w0.254: U1.65 46.21,20.41 47.89,20.41 U21.7
WS2812B: length 37.5
  Top Layer w0.254: LED2.4 v1(73.53,36.69)
  Bottom Layer w0.254: U1.26 45.62,40.35 49.15,40.35 49.66,39.84 49.66,37.55 50,37.21 71.59,37.21 72.11,36.69 v1(73.53,36.69)
$1N2697: length 2
  Bottom Layer w0.254: U2.8 59.45,17.57 C3.1
$1N2951: length 3.4
  Bottom Layer w0.254: U2.6 59.41,14.83 R7.1 R8.2
$1N16688: length 4.4
  Bottom Layer w0.254: R13.2 26.53,30.32 26.7,30.16 Q4.1 27.37,29.62 27.69,29.3 R14.2
$1N16689: length 8
  Top Layer w0.254: v1(22.35,33.49) 23.75,33.49 23.88,33.36 29.03,33.36 U11.2
  Bottom Layer w0.254: R12.2 v1(22.35,33.49)
$1N16699: length 8.6
  Bottom Layer w0.254: R12.1 29.59,33.49 29.97,33.11 29.97,30.95 29.59,30.57 28.68,30.57
$1N17448: length 9
  Top Layer w0.254: R15.2 U12.2 46.23,20.66 45.78,20.22 C38.1
$1N17624: length 8.9
  Top Layer w0.254: R16.2 U13.2 53.34,20.66 53.66,20.35 C39.1
$1N17748: length 12.8
  Top Layer w0.254: C40.1 62.42,23.77 62.87,23.33 U14.2 62.88,21.3 66.67,21.3 66.93,21.55 R17.2
$1N17872: length 16
  Top Layer w0.254: R18.2 66.93,12.66 66.55,12.28 62.88,12.28 U15.2 62.87,16.47 62.61,16.73 60.45,16.73 60.12,16.4 60.12,15.89 59.94,15.71 59.37,15.71 C41.1
$1N18033: length 10.3
  Bottom Layer w0.254: D2.1 76.95,31.03 Q3.3
  Bottom Layer w0.508: U19.1 73.03,34.51 76.45,34.51 76.96,34 Q3.3
$1N18088: length 3.4
  Bottom Layer w0.254: R19.2 R22.2 77.91,26.94 Q3.1
$1N32190: length 2
  Bottom Layer w0.254: U18.8 71.75,16.2 71.75,17.49 72.2,17.93 C46.1
$1N32192: length 3.4
  Bottom Layer w0.254: R27.2 R28.1 70.02,14.88 U18.6
$1N54508: length 1.7
  Top Layer w0.254: R21.2 LED1.1

## Copper pours and planes (outline as drawn; the poured copper is in the pictures)
5V on Top Layer: 35.56,7.84 37.08,7.84 37.08,6.44 35.56,6.44
5V on Top Layer: 68.83,11.27 71.63,11.27 71.63,8.34 68.83,8.34
5V on Top Layer: 13.84,7.84 15.37,7.84 15.37,6.19 13.84,6.19
5V on Bottom Layer: 35.56,12.28 37.08,12.28 37.08,6.44 35.56,6.44
5V on Bottom Layer: 74.55,8.85 74.55,14.44 71.12,14.44 71.12,13.02 70.64,12.54 69.22,12.54 68.83,12.15 68.83,8.73 69.24,8.32 74.02,8.32
5V on Bottom Layer: 13.84,12.28 15.37,12.28 15.37,6.44 13.84,6.44
5V on PWR: 68.83,20.03 75.06,20.03 75.06,14.31 68.83,14.31
5V on PWR: 68.83,16.26 76.64,16.26 76.64,8.22 68.83,8.22
12.6V on Bottom Layer: 79.38,18.5 79.38,15.7 79.01,15.33 73.66,15.33 73.66,16.6 74.68,16.6 74.8,16.73 74.8,18.5 75.06,18.76 79.12,18.76
12.6V on Bottom Layer: 13.21,31.08 13.21,28.79 13.46,28.54 18.8,28.54 19.05,28.79 19.05,30.95 19.18,31.08 19.69,31.08 19.69,24.17 19.65,24.13 12.02,24.13 11.81,24.35 11.81,26.62 11.49,26.94 9.56,26.94 9.28,27.21 9.28,29.65 9.52,29.89 9.52,31.27 9.68,31.42 12.86,31.42
12.6V on Bottom Layer: 67.06,18.48 67.06,15.67 66.7,15.31 61.35,15.31 61.35,16.58 62.37,16.58 62.49,16.7 62.49,18.48 62.75,18.74 66.81,18.74
12.6V on PWR: 11.77,29.05 20.19,29.05 20.19,25.15 11.77,25.15
12.6V on PWR: 61.47,19.97 83.7,19.97 83.7,-0.67 61.47,-0.67
GND on Top Layer: -5.59,54.83 86.49,54.83 86.49,-6.01 -5.59,-6.01
GND on Bottom Layer: 13.28,24.1 14.5,24.1 14.5,16.82 13.28,16.82
GND on Bottom Layer: 17.23,24.08 18.45,24.08 18.45,16.81 17.23,16.81
GND on Bottom Layer: -4.7,54.32 89.15,54.32 89.15,-4.99 -4.7,-4.99
GND on GND: 0.26,49.74 81.74,49.74 81.74,0.26 0.26,0.26
VDD on Top Layer: 23.96,32.83 31.62,32.83 31.62,31.59 23.96,31.59
VDD on Bottom Layer: 62.19,8.85 62.19,14.44 58.76,14.44 58.76,13.02 58.28,12.53 56.85,12.53 56.47,12.15 56.47,8.72 56.88,8.32 61.66,8.32
VDD on PWR: -2.67,52.79 85.98,52.79 85.98,-2.83 -2.67,-2.83
AO1 on Bottom Layer: 18.54,24.09 19.69,24.09 19.69,21.81 18.54,21.81
AO2 on Bottom Layer: 15.96,24.09 17.1,24.09 17.1,21.83 15.96,21.83
BO1 on Bottom Layer: 12.06,24.09 13.21,24.09 13.21,21.81 12.06,21.81
BO2 on Bottom Layer: 14.65,24.07 15.83,24.07 15.83,21.85 14.65,21.85

Small or netless copper shapes (teardrops, artwork), in the pictures only: 105 on Top Layer, 187 on Bottom Layer, 4 on PWR, 32 on GND

## Text on the board
Bottom Silkscreen Layer: BOOT1 | BOOT0
Top Silkscreen Layer: . | PB7 | 5V | PB6 | PB14 | PD6 | PB15 | PD5 | PE13 | PA12 | PB10 | PA11 | PE6 | GND | PE5 | 3V3 | CLK | TX | RX | DIO | NC | Icm45686 | AO1 | A | B | AO2
